# EasyEDA Pro project Loongson_Continuation.epro, schematic Schematic1

## Sheets
1 P1: Board Name: Board1; Create Date: 2025-04-16; Page Name: P1; Project Name: 龙芯拓展板第三版; Schematic Name: Schematic1; Update Date: 2025-06-16; Company: 嘉立创EDA; Page Size: A4; Version: V1.0
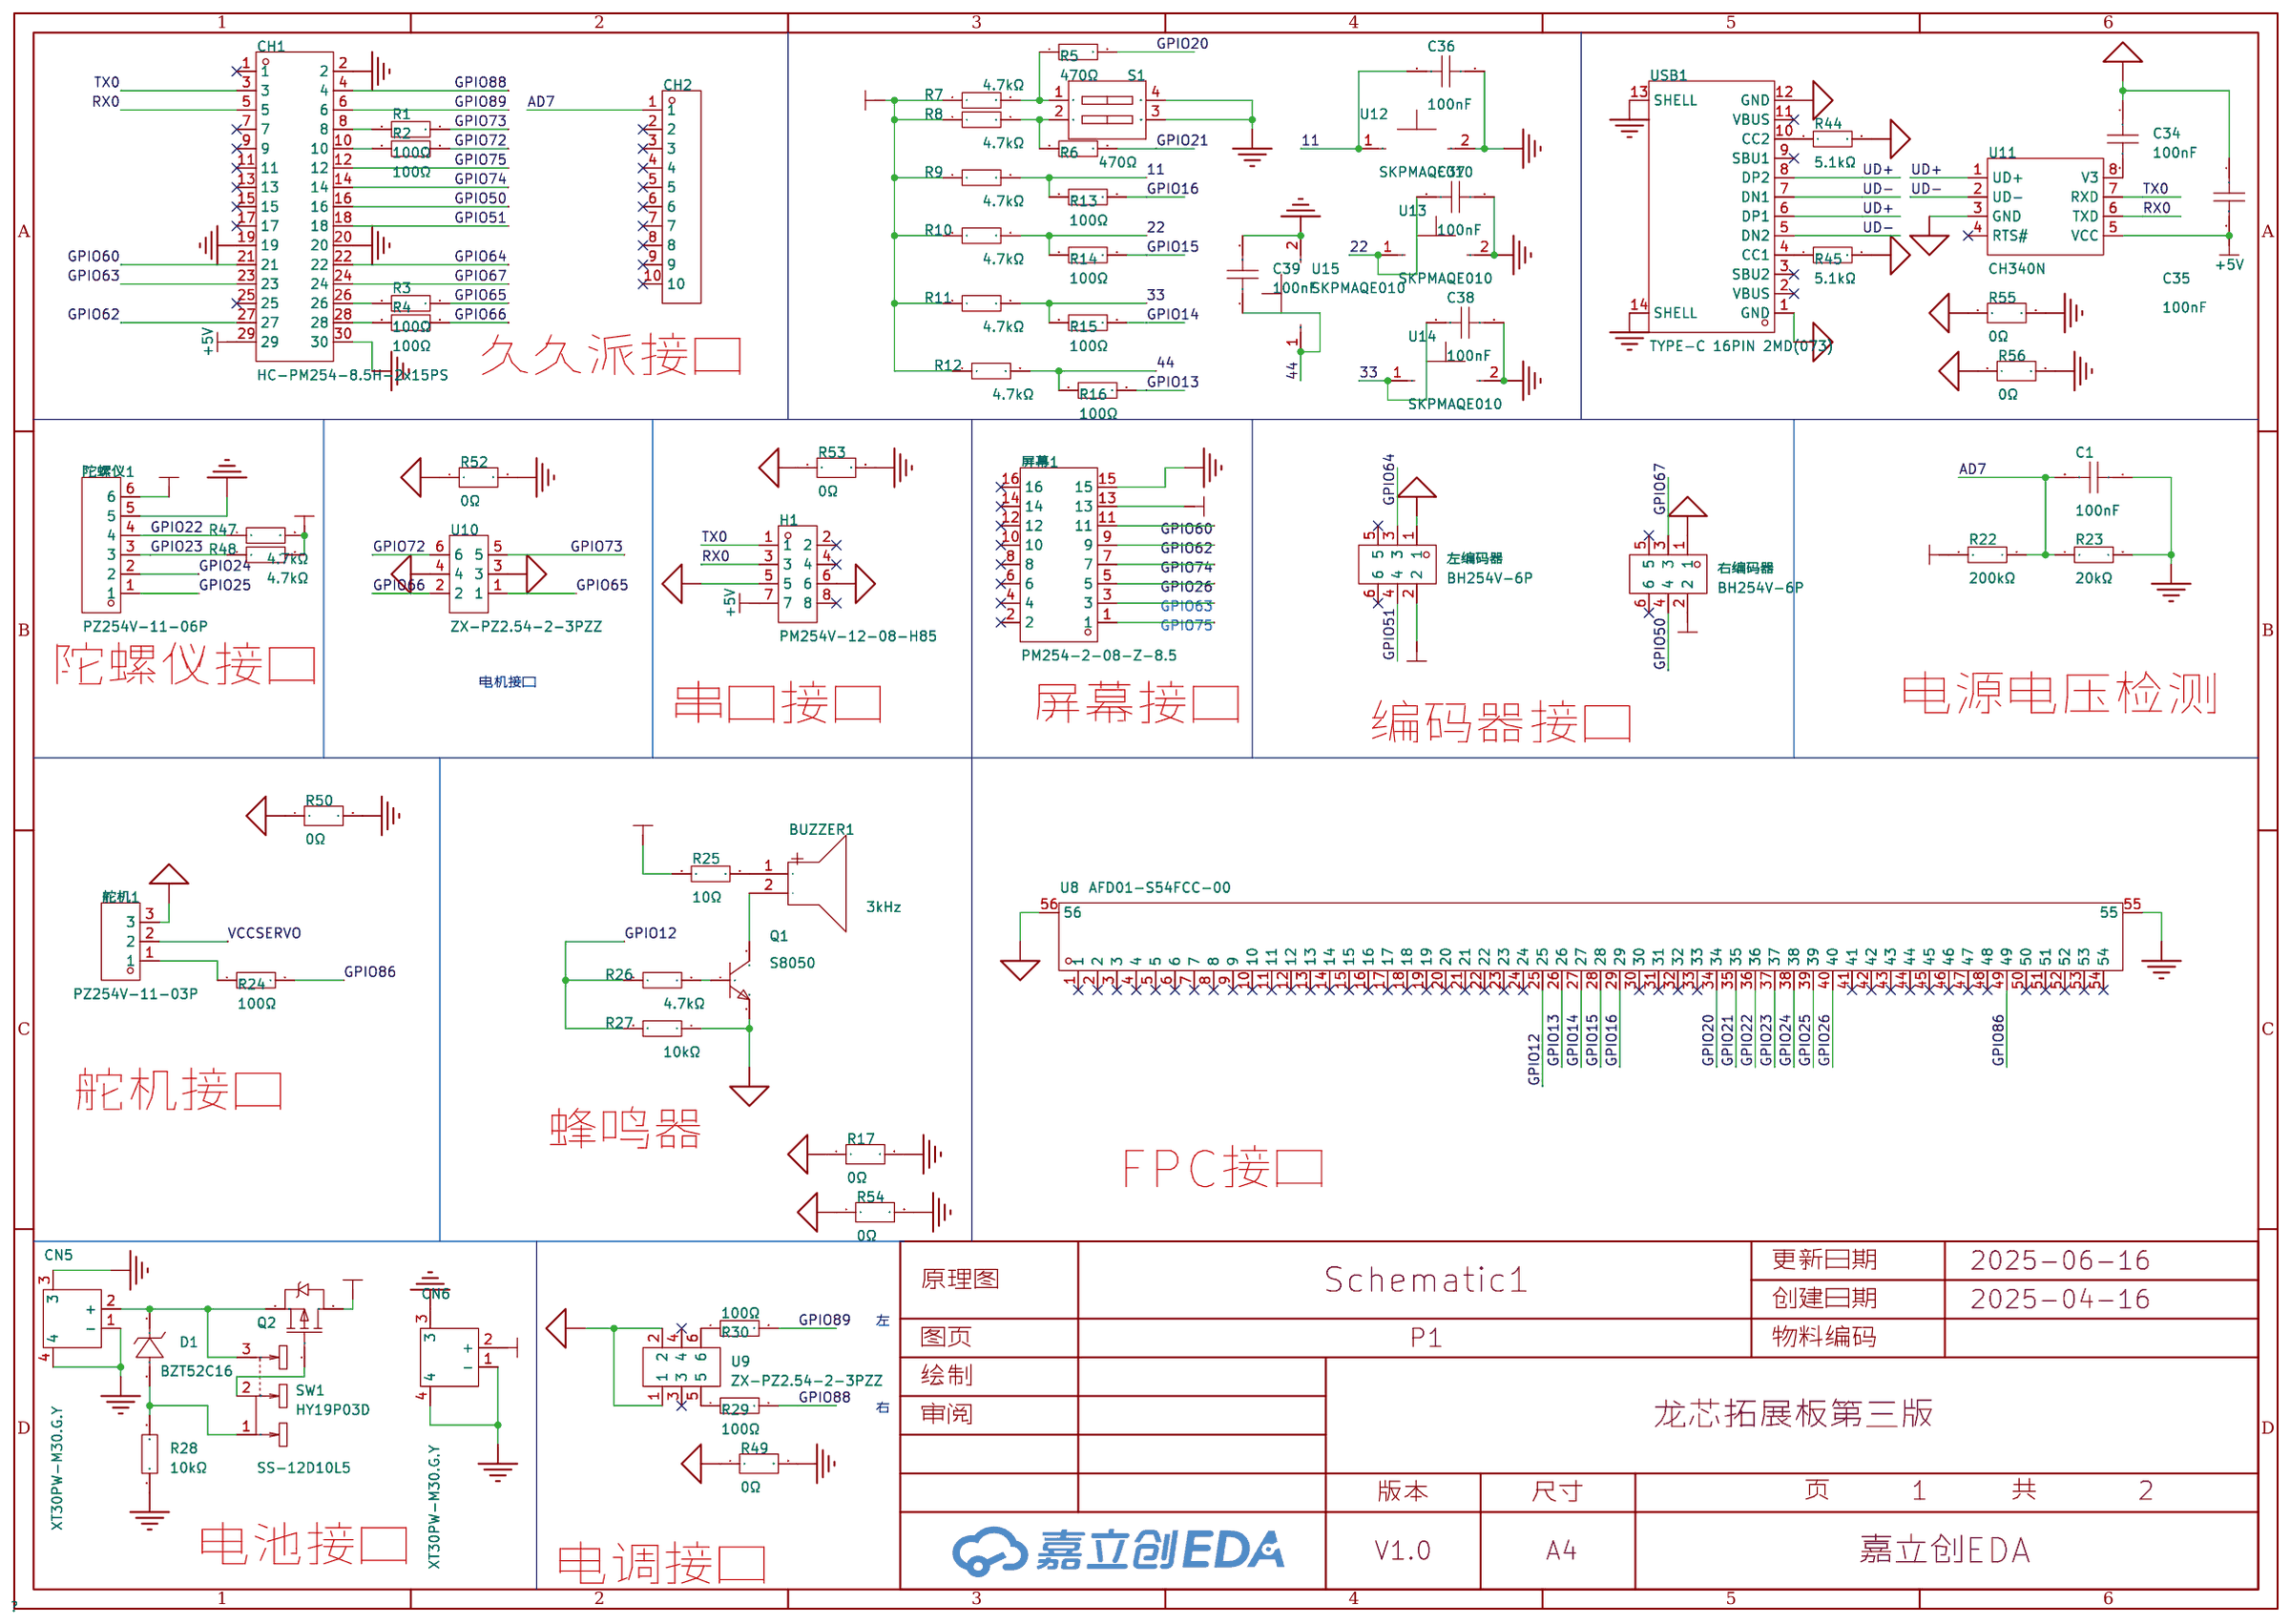
[diagram p0: P1]
2 P2: Page Name: P2; Update Date: 2025-04-16
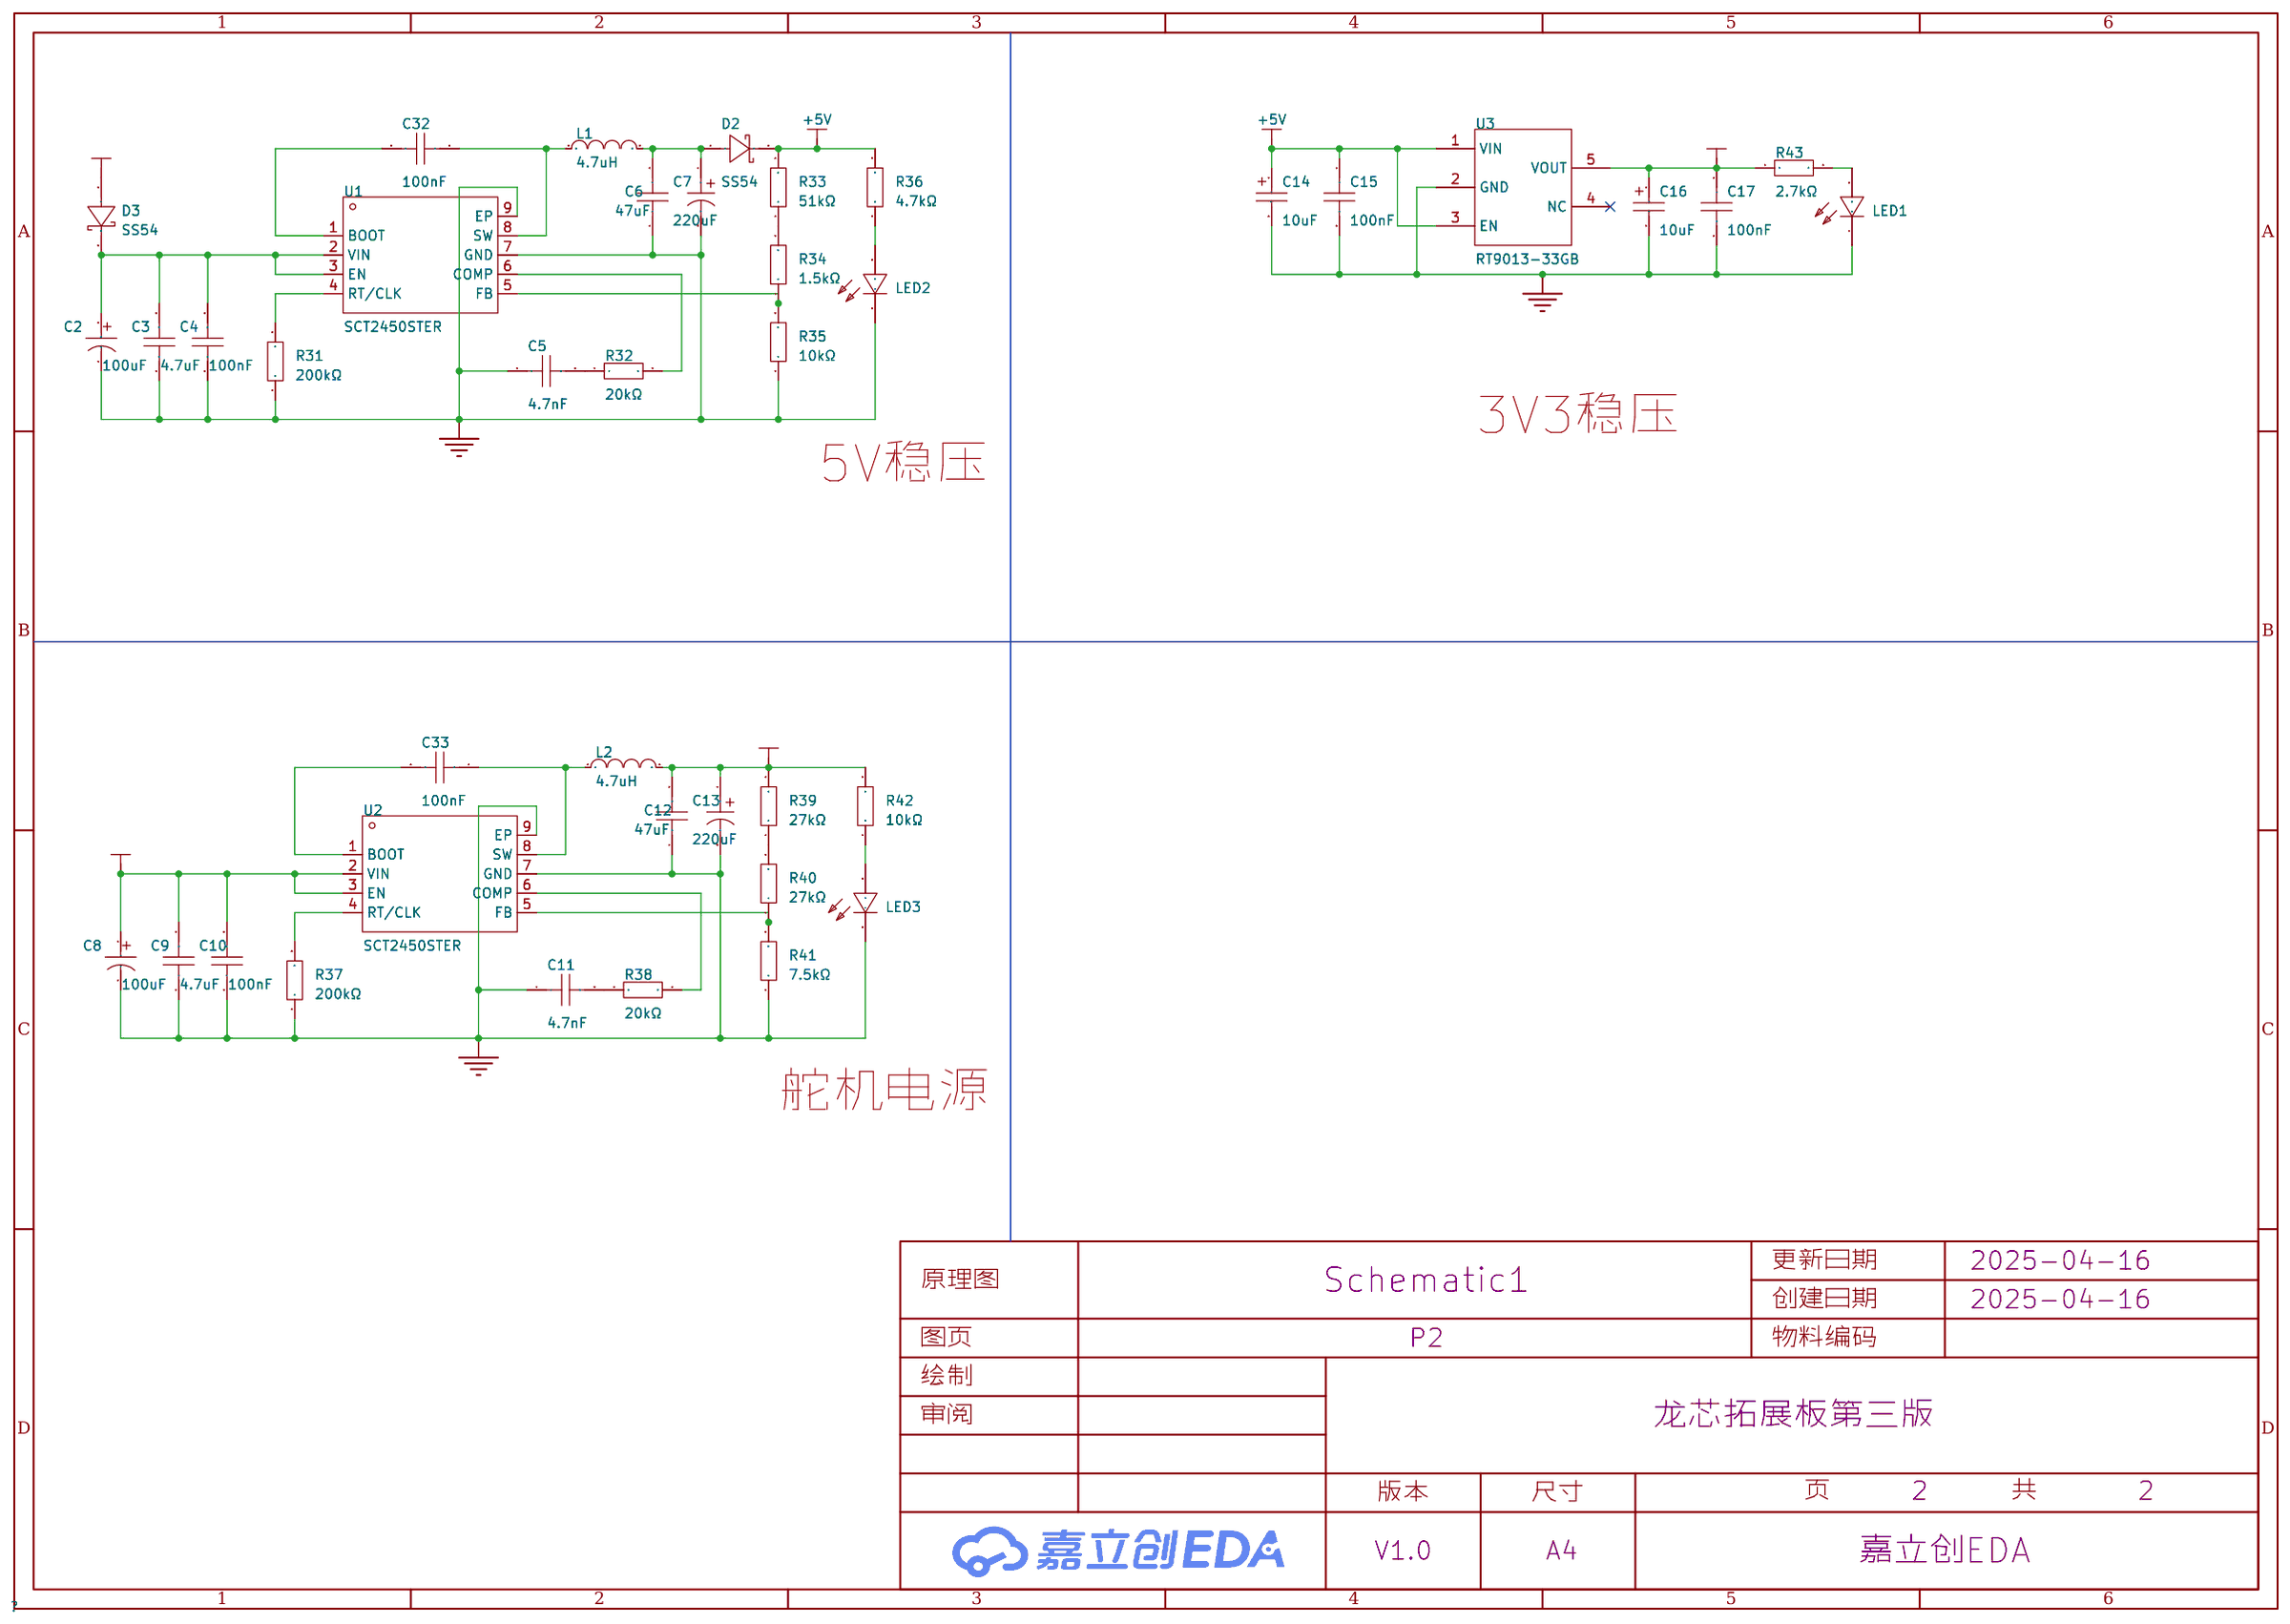
[diagram p1: P2]

## Parts
sheet P1
BUZZER1  3kHz  [BUZ-TH_BD9.0-P5.00-D0.6-FD]
C1  100nF  [C0603]
C34  100nF  [C0603]
C35  100nF  [C0603]
C36  100nF  [C0603]
C37  100nF  [C0603]
C38  100nF  [C0603]
C39  100nF  [C0603]
CH1  HC-PM254-8.5H-2x15PS  [HDR-SMD_30P-P2.54-V-F-R2-C15-LS7.1-1]
CH2  HX PM2.54-1x10P TP-YQ  [HDR-SMD_10P-P2.54-V-F-LS4.7_R2]
CN5  XT30PW-M30.G.Y  [CONN-TH_XT30PW-M]
CN6  XT30PW-M30.G.Y  [CONN-TH_XT30PW-M]
D1  BZT52C16  [SOD-123_L2.7-W1.6-LS3.7-RD]
H1  PM254V-12-08-H85  [HDR-TH_8P-P2.54-V-F-R2-C4-S2.54]
Q1  S8050  [SOT-23-3_L2.9-W1.6-P1.90-LS2.8-BR]
Q2  HY19P03D  [TO-252-2_L6.6-W6.1-P4.57-LS9.9-TL-CW]
R1  100Ω  [R0603]
R2  100Ω  [R0603]
R3  100Ω  [R0603]
R4  100Ω  [R0603]
R5  470Ω  [R0603]
R6  470Ω  [R0603]
R7  4.7kΩ  [R0603]
R8  4.7kΩ  [R0603]
R9  4.7kΩ  [R0603]
R10  4.7kΩ  [R0603]
R11  4.7kΩ  [R0603]
R12  4.7kΩ  [R0603]
R13  100Ω  [R0603]
R14  100Ω  [R0603]
R15  100Ω  [R0603]
R16  100Ω  [R0603]
R17  0Ω  [R1206]
R22  200kΩ  [R0603]
R23  20kΩ  [R0603]
R24  100Ω  [R0603]
R25  10Ω  [R0603]
R26  4.7kΩ  [R0603]
R27  10kΩ  [R0603]
R28  10kΩ  [R0603]
R29  100Ω  [R0603]
R30  100Ω  [R0603]
R44  5.1kΩ  [R0603]
R45  5.1kΩ  [R0603]
R47  4.7kΩ  [R0603]
R48  4.7kΩ  [R0603]
R49  0Ω  [R1206]
R50  0Ω  [R1206]
R52  0Ω  [R1206]
R53  0Ω  [R1206]
R54  0Ω  [R1206]
R55  0Ω  [R1206]
R56  0Ω  [R1206]
S1  DSIC02LS-P  [SW-SMD_4P-L5.1-W6.1-P2.54-LS9.8]
SW1  SS-12D10L5  [SW-TH_SS-12D10L5]
U8  AFD01-S54FCC-00  [FPC-SMD_54P-P0.50_AFD01-S54FCA-00]
U9  ZX-PZ2.54-2-3PZZ  [HDR-TH_6P-P2.54-V-M-R2-C3-S2.54-1]
U10  ZX-PZ2.54-2-3PZZ  [HDR-TH_6P-P2.54-V-M-R2-C3-S2.54-1]
U11  CH340N  [SOP-8_L4.9-W3.9-P1.27-LS6.0-BL]
U12  SKPMAQE010  [KEY-SMD_2P-L6.0-W6.0-P6.00]
U13  SKPMAQE010  [KEY-SMD_2P-L6.0-W6.0-P6.00]
U14  SKPMAQE010  [KEY-SMD_2P-L6.0-W6.0-P6.00]
U15  SKPMAQE010  [KEY-SMD_2P-L6.0-W6.0-P6.00]
USB1  TYPE-C 16PIN 2MD(073)  [USB-C-SMD_TYPE-C-6PIN-2MD-073]
右编码器  BH254V-6P  [IDC-TH_6P-P2.54-V-R2-C3-S2.54]
屏幕1  PM254-2-08-Z-8.5  [HDR-TH_16P-P2.54-V-F-R2-C8-S2.54]
左编码器  BH254V-6P  [IDC-TH_6P-P2.54-V-R2-C3-S2.54]
舵机1  PZ254V-11-03P  [HDR-TH_3P-P2.54-V-M]
陀螺仪1  PZ254V-11-06P  [HDR-TH_6P-P2.54-V-M]
sheet P2
C2  100uF  [CAP-SMD_BD6.3-L6.6-W6.6-LS7.6-FD]
C3  4.7uF  [C1206]
C4  100nF  [C0603]
C5  4.7nF  [C0603]
C6  47uF  [C1206]
C7  220uF  [CAP-SMD_BD6.3-L6.6-W6.6-LS7.4-FD]
C8  100uF  [CAP-SMD_BD6.3-L6.6-W6.6-LS7.6-FD]
C9  4.7uF  [C1206]
C10  100nF  [C0603]
C11  4.7nF  [C0603]
C12  47uF  [C1206]
C13  220uF  [CAP-SMD_BD6.3-L6.6-W6.6-LS7.4-FD]
C14  10uF  [CAP-SMD_L3.2-W1.6-RD-C7171]
C15  100nF  [C0603]
C16  10uF  [CAP-SMD_L3.2-W1.6-RD-C7171]
C17  100nF  [C0603]
C32  100nF  [C0603]
C33  100nF  [C0603]
D2  SS54  [SMA_L4.3-W2.6-LS5.0-FD]
D3  SS54  [SMA_L4.3-W2.6-LS5.0-FD]
L1  4.7uH  [IND-SMD_L5.4-W5.2_FXL0530]
L2  4.7uH  [IND-SMD_L5.4-W5.2_FXL0530]
LED1  NCD0603R1  [LED0603-RD_RED]
LED2  NCD0603R1  [LED0603-RD_RED]
LED3  NCD0603B1  [LED0603-RD]
R31  200kΩ  [R0603]
R32  20kΩ  [R0603]
R33  51kΩ  [R0603]
R34  1.5kΩ  [R0603]
R35  10kΩ  [R0603]
R36  4.7kΩ  [R0603]
R37  200kΩ  [R0603]
R38  20kΩ  [R0603]
R39  27kΩ  [R0603]
R40  27kΩ  [R0603]
R41  7.5kΩ  [R0603]
R42  10kΩ  [R0603]
R43  2.7kΩ  [R0603]
U1  SCT2450STER  [ESOP-8_L4.9-W3.9-P1.27-LS6.0-BL-EP]
U2  SCT2450STER  [ESOP-8_L4.9-W3.9-P1.27-LS6.0-BL-EP]
U3  RT9013-33GB  [SOT-23-5_L3.0-W1.7-P0.95-LS2.8-BL]

## Library data of the parts
BUZZER1 = HNB09A03: 驱动方式:有源(内含驱动线路);构造类型:电磁式;频率:3kHz;声压(SPL):85dB;; LCSC Part Name: 电磁式有源一体蜂鸣器HNB09A03; Supplier Part: C96102; Manufacturer: 华能; Supplier Footprint: 插件,D=9mm; JLCPCB Part Class: 扩展库; Datasheet: https://atta.szlcsc.com/upload/public/pdf/source/20241128/61C4C8C3938BB25F7C38FBE94CCE8DCF.pdf; Supplier: LCSC; Driver Circuitry: 有源(内含驱动线路); Technology: 电磁式; Voltage - Supply: 1.5V~4.5V; Current Consumption: 30mA; Sound Pressure Level(SPL): 85dB; Diameter(φD): 9mm; Height: 5.5mm; Operating Temperature: -20℃~+70℃
C1 C4 C10 C15 C17 C32-C39 = CGA0603X7R104K500JT: 容值:100nF;精度:±10%;额定电压:50V;材质(温度系数):X7R;; LCSC Part Name: 100nF ±10% 50V; Supplier Part: C6119867; Manufacturer: HRE(芯声); Supplier Footprint: 0603; JLCPCB Part Class: 扩展库; Supplier: LCSC; Tolerance: ±10%; Voltage Rated: 50V; Temperature Coefficient: X7R
CH1 = HC-PM254-8.5H-2x15PS: 插孔结构:2x15P;间距:2.54mm;行距:2.54mm;圆孔/方孔:方孔;安装方式:立贴;排数:双排;总孔位数:30P;额定电流:3A;额定电压:-;插孔方向:顶部;塑高:8.5mm;触头材质:黄铜;触头镀层:金;工作温度:-40℃~+105℃;; LCSC Part Name: 间距2.54mm 2x15Pin 立贴 PW7.1 H8.5; Supplier Part: C22436162; Manufacturer: HC(虹成电子); Supplier Footprint: SMD,P=2.54mm; JLCPCB Part Class: 扩展库; Datasheet: https://atta.szlcsc.com/upload/public/pdf/source/20250106/3F7BD0B657317383F8764DF35D106174.pdf; Supplier: LCSC; Holes Structure: 2x15P; Pitch: 2.54mm; Row Spacing: 2.54mm; Circular Hole / Square Hole: 方孔; Mounting Type: 立贴; Number of Rows: 双排; Number of Positions: 30P; Current Rating: 3A; Holes Direction: 顶部; Insulation Height: 8.5mm; Contact Material: 黄铜; Contact Plating: 金; Operating Temperature: -40℃~+105℃
CH2 = HX PM2.54-1x10P TP-YQ: 插孔结构:1x10P;间距:2.54mm;行距:-;圆孔/方孔:方孔;安装类型:立贴;排数:单排;总孔位数:10P;额定电流:3A;插孔方向:顶部;塑高:5mm;触头镀层:金;工作温度范围:-40℃~+105℃;; LCSC Part Name: 间距:2.54mm 1x10P 立贴 (交错脚); Supplier Part: C42379201; Manufacturer: hanxia(韩下); Supplier Footprint: SMD,P=2.54mm(交错脚); Datasheet: https://atta.szlcsc.com/upload/public/pdf/source/20241112/1B0821B5F82B034A310C73580E919DF4.pdf; Supplier: LCSC; Holes Structure: 1x10P; Pitch: 2.54mm; Circular Hole / Square Hole: 方孔; Mounting Type: 立贴; Number of Rows: 单排; Number of Holes: 10P; Current Rating (Max): 3A; Holes Direction: 顶部; Insulation Height: 5mm; Contact Plating: 金; Operating Temperature Range: -40℃~+105℃
CN5 CN6 = XT30PW-M30.G.Y: 类别:-;类型1:-;; LCSC Part Name: AMASS(艾迈斯)航模插头 卧式弯脚 XT30PW-M公头; Supplier Part: C431092; Manufacturer: AMASS(艾迈斯); JLCPCB Part Class: 扩展库; Datasheet: https://atta.szlcsc.com/upload/public/pdf/source/20220222/6A9F22F7850E25B33E1BE430ADF8560B.pdf; Supplier: LCSC; Type: 航模插头; RatedVoltage: DC 500V; InterfaceType: 公头; RatedCurrent: 15A; RecommendedWireGauge: 16/18/20AWG; contact resistance: 1.2mΩ; specifications: 2pin
D1 = BZT52C16_C19077413: 二极管配置:独立式;稳压值(标称值):16V;稳压值(范围):15.2V~16.8V;耗散功率(Pd):500mW;; Supplier Part: C19077413; Manufacturer: 宏嘉诚; Supplier Footprint: SOD-123; JLCPCB Part Class: 扩展库; Datasheet: https://atta.szlcsc.com/upload/public/pdf/source/20250106/E12AA82D484C9C66E469D005F460C1F7.pdf; Supplier: LCSC; Diode Configuration: 独立式; Zener Voltage(Nom): 16V; Reverse Leakage Current (Ir): 100nA@11.2V; Zener Voltage(Range): 15.2V~16.8V; Pd - Power Dissipation(Pd): 500mW; Impedance(Zzt): 45Ω
H1 = PM254V-12-08-H85: 插孔结构:2x4P;间距:2.54mm;行距:2.54mm;圆孔/方孔:方孔;安装类型:直插;排数:双排;总孔位数:8P;额定电流:3A;额定电压:250V;插孔方向:顶部;塑高:8.5mm;工作温度范围:-40℃~+105℃;; LCSC Part Name: 间距:2.54mm 2x4P 直插; Supplier Part: C2834799; Manufacturer: XFCN(兴飞); Supplier Footprint: 插件,P=2.54mm; JLCPCB Part Class: Extended Part; Datasheet: https://atta.szlcsc.com/upload/public/pdf/source/20200309/C492399_8C441E2934FBB604A89B37A68AA45ECF.pdf; Supplier: LCSC; Holes Structure: 2x4P; Pitch: 2.54mm; Row Spacing: 2.54mm; Circular Hole / Square Hole: 方孔; Mounting Type: 直插; Number of Rows: 双排; Number of Holes: 8P; Current Rating (Max): 3A; Voltage Rating (Max): 250V; Holes Direction: 顶部; Insulation Height: 8.5mm; Operating Temperature Range: -40℃~+105℃
Q1 = S8050_C181158: 晶体管类型:NPN;集电极电流(Ic):500mA;集射极击穿电压(Vceo):25V;功率(Pd):300mW;; LCSC Part Name: NPN 电流:500mA 耐压:25V H档; Supplier Part: C181158; Manufacturer: Hottech(合科泰); Supplier Footprint: SOT-23; JLCPCB Part Class: 扩展库; Datasheet: https://atta.szlcsc.com/upload/public/pdf/source/20220506/D987F39D56F2975D34EC7947E75C4ABC.pdf; Supplier: LCSC; Transistor Type: NPN; Collector Current (Ic): 500mA; Collector-Emitter Breakdown Voltage (Vceo): 25V; Power Dissipation (Pd): 300mW; Transition Frequency (fT): 150MHz; Collector Cut-Off Current (Icbo): 100nA; Collector-Emitter Saturation Voltage (VCE(sat)@Ic,Ib): 600mV@500mA,50mA
Q2 = HY19P03D: 类型:P沟道;漏源电压(Vdss):30V;连续漏极电流(Id):90A;功率(Pd):50W;导通电阻(RDS(on)@Vgs,Id):6mΩ@10V,45A;阈值电压(Vgs(th)@Id):3V@250uA;; LCSC Part Name: P沟道 耐压:30V 电流:90A; Supplier Part: C122492; Manufacturer: HUAYI(华羿微); Supplier Footprint: TO-252-2; JLCPCB Part Class: 扩展库; Datasheet: https://atta.szlcsc.com/upload/public/pdf/source/20170728/C122492_1501225751911848809.pdf; Supplier: LCSC; Type: P沟道; Drain Source Voltage (Vdss): 30V; Continuous Drain Current (Id): 90A; Power Dissipation (Pd): 50W; Drain Source On Resistance (RDS(on)@Vgs,Id): 6mΩ@10V,45A; Gate Threshold Voltage (Vgs(th)@Id): 3V@250uA
R1-R4 R13-R16 R24 R29 R30 = 0603WAF1000T5E: 电阻类型:厚膜电阻;阻值:100Ω;精度:±1%;功率:100mW;最大工作电压:75V;温度系数:±200ppm/℃;; LCSC Part Name: 100Ω ±1% 100mW 厚膜电阻; Supplier Part: C22775; Manufacturer: UNI-ROYAL(厚声); Supplier Footprint: 0603; JLCPCB Part Class: 基础库; Datasheet: https://atta.szlcsc.com/upload/public/pdf/source/20200306/C422600_1E6D84923E4A46A82E41ADD87F860B5C.pdf; Supplier: LCSC; Type: 厚膜电阻; Tolerance: ±1%; Power(Watts): 100mW; Overload Voltage (Max): 75V; Temperature Coefficient: ±200ppm/℃; Operating Temperature Range: -55℃~+155℃
R5 R6 = 0603WAF4700T5E: 电阻类型:厚膜电阻;阻值:470Ω;精度:±1%;功率:100mW;最大工作电压:75V;温度系数:±100ppm/℃;; LCSC Part Name: 470Ω ±1% 100mW 厚膜电阻; Supplier Part: C23179; Manufacturer: UNI-ROYAL(厚声); Supplier Footprint: 0603; JLCPCB Part Class: 基础库; Datasheet: https://atta.szlcsc.com/upload/public/pdf/source/20200306/C422600_1E6D84923E4A46A82E41ADD87F860B5C.pdf; Supplier: LCSC; Type: 厚膜电阻; Tolerance: ±1%; Power(Watts): 100mW; Overload Voltage (Max): 75V; Temperature Coefficient: ±100ppm/℃; Operating Temperature Range: -55℃~+155℃
R7-R12 R26 R36 R47 R48 = 0603WAF4701T5E: 电阻类型:厚膜电阻;阻值:4.7kΩ;精度:±1%;功率:100mW;最大工作电压:75V;温度系数:±100ppm/℃;; LCSC Part Name: 4.7kΩ ±1% 100mW 厚膜电阻; Supplier Part: C23162; Manufacturer: UNI-ROYAL(厚声); Supplier Footprint: 0603; JLCPCB Part Class: 基础库; Datasheet: https://atta.szlcsc.com/upload/public/pdf/source/20200306/C422600_1E6D84923E4A46A82E41ADD87F860B5C.pdf; Supplier: LCSC; Type: 厚膜电阻; Tolerance: ±1%; Power(Watts): 100mW; Overload Voltage (Max): 75V; Temperature Coefficient: ±100ppm/℃; Operating Temperature Range: -55℃~+155℃
R17 R49 R50 R52-R56 = FRC1206P000 TS: 电阻类型:厚膜电阻;阻值:0Ω;精度:±5%;功率:250mW;最大工作电压:200V;; LCSC Part Name: 0Ω ±5% 250mW 厚膜电阻; Supplier Part: C2907406; Manufacturer: FOJAN(富捷); Supplier Footprint: 1206; JLCPCB Part Class: 扩展库; Datasheet: https://atta.szlcsc.com/upload/public/pdf/source/20211221/925EC7D7225764EE0046F22065062C87.pdf; Supplier: LCSC; Type: 厚膜电阻; Tolerance: ±5%; Power(Watts): 250mW; Overload Voltage (Max): 200V; Operating Temperature Range: -55℃~+155℃
R22 R31 R37 = 0603WAF2003T5E: 电阻类型:厚膜电阻;阻值:200kΩ;精度:±1%;功率:100mW;最大工作电压:75V;温度系数:±100ppm/℃;; LCSC Part Name: 200kΩ ±1% 100mW 厚膜电阻; Supplier Part: C25811; Manufacturer: UNI-ROYAL(厚声); Supplier Footprint: 0603; JLCPCB Part Class: 基础库; Datasheet: https://atta.szlcsc.com/upload/public/pdf/source/20200306/C422600_1E6D84923E4A46A82E41ADD87F860B5C.pdf; Supplier: LCSC; Type: 厚膜电阻; Tolerance: ±1%; Power(Watts): 100mW; Overload Voltage (Max): 75V; Temperature Coefficient: ±100ppm/℃; Operating Temperature Range: -55℃~+155℃
R23 R32 R38 = 0603WAF2002T5E: 电阻类型:厚膜电阻;阻值:20kΩ;精度:±1%;功率:100mW;最大工作电压:75V;温度系数:±100ppm/℃;; LCSC Part Name: 20kΩ ±1% 100mW 厚膜电阻; Supplier Part: C4184; Manufacturer: UNI-ROYAL(厚声); Supplier Footprint: 0603; JLCPCB Part Class: 基础库; Datasheet: https://atta.szlcsc.com/upload/public/pdf/source/20200306/C422600_1E6D84923E4A46A82E41ADD87F860B5C.pdf; Supplier: LCSC; Type: 厚膜电阻; Tolerance: ±1%; Power(Watts): 100mW; Overload Voltage (Max): 75V; Temperature Coefficient: ±100ppm/℃; Operating Temperature Range: -55℃~+155℃
R25 = 0603WAF100JT5E: 电阻类型:厚膜电阻;阻值:10Ω;精度:±1%;功率:100mW;最大工作电压:75V;温度系数:±400ppm/℃;; LCSC Part Name: 10Ω ±1% 100mW 厚膜电阻; Supplier Part: C22859; Manufacturer: UNI-ROYAL(厚声); Supplier Footprint: 0603; JLCPCB Part Class: 基础库; Datasheet: https://atta.szlcsc.com/upload/public/pdf/source/20200306/C422600_1E6D84923E4A46A82E41ADD87F860B5C.pdf; Supplier: LCSC; Type: 厚膜电阻; Tolerance: ±1%; Power(Watts): 100mW; Overload Voltage (Max): 75V; Temperature Coefficient: ±400ppm/℃; Operating Temperature Range: -55℃~+155℃
R27 R28 R35 R42 = 0603WAF1002T5E: 电阻类型:厚膜电阻;阻值:10kΩ;精度:±1%;功率:100mW;最大工作电压:75V;温度系数:±100ppm/℃;; LCSC Part Name: 厚膜电阻 10kΩ ±1% 100mW; Supplier Part: C25804; Manufacturer: UNI-ROYAL(厚声); Supplier Footprint: 0603; JLCPCB Part Class: 基础库; Datasheet: https://atta.szlcsc.com/upload/public/pdf/source/20200306/C422600_1E6D84923E4A46A82E41ADD87F860B5C.pdf; Supplier: LCSC; Type: 厚膜电阻; Tolerance: ±1%; Power(Watts): 100mW; Overload Voltage (Max): 75V; Temperature Coefficient: ±100ppm/℃; Operating Temperature Range: -55℃~+155℃
R44 R45 = 0603WAF5101T5E: 电阻类型:厚膜电阻;阻值:5.1kΩ;精度:±1%;功率:100mW;最大工作电压:75V;温度系数:±100ppm/℃;; LCSC Part Name: 5.1kΩ ±1% 100mW 厚膜电阻; Supplier Part: C23186; Manufacturer: UNI-ROYAL(厚声); Supplier Footprint: 0603; JLCPCB Part Class: 基础库; Datasheet: https://atta.szlcsc.com/upload/public/pdf/source/20200306/C422600_1E6D84923E4A46A82E41ADD87F860B5C.pdf; Supplier: LCSC; Type: 厚膜电阻; Tolerance: ±1%; Power(Watts): 100mW; Overload Voltage (Max): 75V; Temperature Coefficient: ±100ppm/℃; Operating Temperature Range: -55℃~+155℃
S1 = DSIC02LS-P_C489174: 类型:平拨,凸起式;电路结构:单刀单掷;开关位数:2位;额定电流:25mA;额定电压:24V;使用寿命:3千次;颜色:黑色;; LCSC Part Name: 间距2.54mm 平拨,凸起式 2位拨码开关; Supplier Part: C489174; Manufacturer: XKB Connectivity(中国星坤); Supplier Footprint: SMD-4P,5.1x6.1mm; JLCPCB Part Class: 扩展库; Datasheet: https://atta.szlcsc.com/upload/public/pdf/source/20200227/C424380_7B5FE7C891E0521A8B96890FFC9096F0.pdf; Supplier: LCSC; Type: 平拨,凸起式; Circuit: 单刀单掷; Number of Positions: 2位; Pin Style: 鸥翼型; Lead Pitch: 2.54mm; Current Rating: 25mA; Voltage Rating: 24V; Operating Temperature: -20℃~+70℃; Operating Life: 3千次; Color: 黑色
SW1 = SS-12D10L5: 电路结构:单刀双掷;安装方式:直插;开关颜色:黑色;额定电流(DC):3A;额定电压(DC):125V;额定电流(AC):3A;额定电压(AC):125V;机械寿命:1万次;; LCSC Part Name: 柄长5mm 直插双档 滑动开关; Supplier Part: C319012; Manufacturer: XKB Connectivity(中国星坤); Supplier Footprint: 插件; JLCPCB Part Class: 扩展库; Datasheet: https://atta.szlcsc.com/upload/public/pdf/source/20211009/D6412F37AABE6F9459A6EE7FA4DAEADB.pdf; Supplier: LCSC; Circuit: 单刀双掷; Actuator Style: 矩形柱状; Pin Style: PC引脚; Switch Length: 13mm; Switch Width: 6.8mm; Switch Height: 6.4mm; Mounting Style: 直插; Actuator Color: 黑色; Current Rating (DC): 3A; Voltage Rating (DC): 125V; Current Rating (AC): 3A; Voltage Rating (AC): 125V; Mechanical Life: 1万次; Operating Temperature: -40℃~+85℃
U8 = AFD01-S54FCC-00: 锁定特性:翻盖式;触点类型:下接;触点数量:54P;间距:0.5mm;安装类型:卧贴;; LCSC Part Name: 间距:0.5mm P数:54P 翻盖式 下接; Supplier Part: C18198568; Manufacturer: JS(钜硕电子); Supplier Footprint: SMD,P=0.5mm,卧贴; JLCPCB Part Class: 扩展库; Datasheet: https://atta.szlcsc.com/upload/public/pdf/source/20230921/C984413AEFF3A883511B509B58F9A1F7.pdf; Supplier: LCSC; Locking Feature: 翻盖式; Contact Type: 下接; Number of Contacts: 54P; Pitch: 0.5mm; Mounting Type: 卧贴; Height Above Board: 2mm
U9 U10 = ZX-PZ2.54-2-3PZZ: 插针结构:2x3P;间距:2.54mm;行距:2.54mm;圆针/方针:方针;安装方式:直插;排数:双排;总PIN位数:6P;额定电流:3A;额定电压:1kV;配合针长度:6mm;塑高:2.5mm;端接针长度:3mm;触头材质:黄铜;触头镀层:金;工作温度:-40℃~+105℃;颜色:黑色;; LCSC Part Name: 2x3P 间距:2.54mm 方针 直插; Supplier Part: C7501274; Manufacturer: Megastar(兆星); Supplier Footprint: 插件,P=2.54mm; JLCPCB Part Class: 扩展库; Datasheet: https://atta.szlcsc.com/upload/public/pdf/source/20231122/E8390501A702A71E626C593F036B3607.pdf; Supplier: LCSC; Pin Structure: 2x3P; Pitch: 2.54mm; Row Spacing: 2.54mm; Circluar Pins/Square Pins: 方针; Mounting Type: 直插; Number of Rows: 双排; Number of Pins: 6P; Current Rating: 3A; Voltage Rating (Max): 1kV; Length of Mating Pin: 6mm; Insulation Height: 2.5mm; Length of End Connection Pin: 3mm; Contact Material: 黄铜; Contact Plating: 金; Operating Temperature: -40℃~+105℃; Color: 黑色
U11 = CH340N: 应用功能:USB转串口;接口协议:USB 2.0;通道数:1;数据速率:2Mbps;; LCSC Part Name: USB2.0芯片CH340; Supplier Part: C2977777; Manufacturer: WCH(南京沁恒); Supplier Footprint: SOP-8; JLCPCB Part Class: 扩展库; Datasheet: https://atta.szlcsc.com/upload/public/pdf/source/20240313/115CDE92081B1D6CB446704AD5D0F5F2.pdf; Supplier: LCSC; Applications Function: USB转串口; Protocol: USB 2.0; Number of Channels: 1; Voltage - Supply: 3.3V；5V; Data Rate: 2Mbps; Operating Temperature: -20℃~+70℃
U12-U15 = SKPMAQE010: 6*6*5mm 立贴 硅胶软开关 无声静音开关 电路结构:单刀单掷 触点电流:50mA 额定电压(DC):16V 安装方式:立贴 动作力:3.5N 操作寿命:5万次 行程:1.3mm 用途:汽车音响,汽车导航,音响设备,手持设备,通讯设备,测量仪器等各种操作; Supplier Part: C19274389; Manufacturer: ALPSALPINE(阿尔卑斯阿尔派); Supplier Footprint: SMD,6.6x6mm; JLCPCB Part Class: 扩展库; Datasheet: https://atta.szlcsc.com/upload/public/pdf/source/20231201/D724ADF6978EA66A095344C51B88B412.pdf; Supplier: LCSC
USB1 = TYPE-C 16PIN 2MD(073): 连接器类型:Type-C;标准:USB 3.1;公母:母;安装方式:卧贴;触点数量:16P;端口数量:1;额定电流 - 电源:5A;工作温度范围:-25℃~+85℃;; LCSC Part Name: Type-C 母 卧贴; Supplier Part: C2765186; Manufacturer: SHOU HAN(首韩); Supplier Footprint: SMD; JLCPCB Part Class: 扩展库; Datasheet: https://atta.szlcsc.com/upload/public/pdf/source/20211123/39B17C16241EAC15C5E277BDA434118E.pdf; Supplier: LCSC; Connector Type: Type-C; Standard: USB 3.1; Gender: 母; Mounting Style: 卧贴; Number of Contacts: 16P; Number of Ports: 1; Current Rating - Power (Max): 5A; Operating Temperature Range: -25℃~+85℃; Rated Voltage (Max): 5V; Connect-Disconnect Life: 5千次; Core Colour: 黑色
右编码器 左编码器 = BH254V-6P: 连接器类型:简牛座;间距:2.54mm;结构:2x3P;额定电流:3A;额定电压:250V;封装形式:直插;行距:2.54mm;排数:2;每排PIN数:3;工作温度范围:-40℃~+105℃;; LCSC Part Name: 2.54mm 2x3P 排数:2 每排P数:3; Supplier Part: C492441; Manufacturer: XFCN(兴飞); Supplier Footprint: 插件,P=2.54mm; JLCPCB Part Class: 扩展库; Datasheet: https://atta.szlcsc.com/upload/public/pdf/source/20200312/C492444_4AABE2FC4F6BE8226B85135616AF0092.pdf; Supplier: LCSC; Connector Type: 简牛座; Pitch: 2.54mm; Structure: 2x3P; Current Rating (Max): 3A; Voltage Rating (Max): 250V; Holder Type: 直插; Row Spacing: 2.54mm; Number of Rows: 2; Pin Number in each Row: 3; Operating Temperature Range: -40℃~+105℃
屏幕1 = PM254-2-08-Z-8.5: 插孔结构:2x8P;间距:2.54mm;行距:2.54mm;圆孔/方孔:方孔;安装类型:直插;排数:双排;总孔位数:16P;额定电流:3A;额定电压:-;插孔方向:顶部;塑高:8.5mm;触头材质:铜合金;工作温度范围:-40℃~+105℃;焊接温度(最大值):260℃@5S;; LCSC Part Name: 2x8P 间距:2.54mm 直插; Supplier Part: C2897409; Manufacturer: HCTL(华灿天禄); Supplier Footprint: 插件,P=2.54mm; JLCPCB Part Class: 扩展库; Datasheet: https://atta.szlcsc.com/upload/public/pdf/source/20230609/3D36CA2C1BFC9FD1C3F709AD9DFEB9C2.pdf; Supplier: LCSC; Holes Structure: 2x8P; Pitch: 2.54mm; Row Spacing: 2.54mm; Circular Hole / Square Hole: 方孔; Mounting Type: 直插; Number of Rows: 双排; Number of Holes: 16P; Current Rating (Max): 3A; Holes Direction: 顶部; Insulation Height: 8.5mm; Contact Material: 铜合金; Operating Temperature Range: -40℃~+105℃; Soldering Temperature(Max): 260℃@5S
舵机1 = PZ254V-11-03P: 插针结构:1x3P;间距:2.54mm;行距:-;圆针/方针:方针;安装类型:直插;排数:单排;总PIN位数:3P;额定电流:3A;额定电压:250V;配合针长度:6mm;塑高:2.5mm;端接针长度:3mm;工作温度范围:-40℃~+105℃;颜色:黑色;; LCSC Part Name: 间距:2.54mm 1x3P 直插 方针; Supplier Part: C2937625; Manufacturer: XFCN(兴飞); Supplier Footprint: 插件,P=2.54mm; JLCPCB Part Class: 扩展库; Datasheet: https://atta.szlcsc.com/upload/public/pdf/source/20200309/C492402_8335C3D49C4E4C618838D59BB1D024C1.pdf; Supplier: LCSC; Pin Structure: 1x3P; Pitch: 2.54mm; Circluar Pins/Square Pins: 方针; Mounting Type: 直插; Number of Rows: 单排; Number of Pins: 3P; Current Rating (Max): 3A; Voltage Rating (Max): 250V; Length of Mating Pin: 6mm; Insulation Height: 2.5mm; Length of End Connection Pin: 3mm; Operating Temperature Range: -40℃~+105℃; Color: 黑色
陀螺仪1 = PZ254V-11-06P: 插针结构:1x6P;间距:2.54mm;行距:-;圆针/方针:方针;安装类型:直插;排数:单排;总PIN位数:6P;额定电流:-;额定电压:-;配合针长度:6mm;塑高:2.5mm;端接针长度:3mm;触头材质:黄铜;触头镀层:-;工作温度范围:-40℃~+105℃;颜色:黑色;; LCSC Part Name: 间距:2.54mm 1x6P 直插 方针; Supplier Part: C492405; Manufacturer: XFCN(兴飞); Supplier Footprint: 插件,P=2.54mm; JLCPCB Part Class: 扩展库; Datasheet: https://atta.szlcsc.com/upload/public/pdf/source/20200309/C492405_597F1930F5B55CC3C7FD95458F1C3977.pdf; Supplier: LCSC; Pin Structure: 1x6P; Pitch: 2.54mm; Circluar Pins/Square Pins: 方针; Mounting Type: 直插; Number of Rows: 单排; Number of Pins: 6P; Length of Mating Pin: 6mm; Insulation Height: 2.5mm; Length of End Connection Pin: 3mm; Contact Material: 黄铜; Operating Temperature Range: -40℃~+105℃; Color: 黑色
C2 C8 = RVT1V101M0607: 容值:100uF;精度:±20%;额定电压:35V;纹波电流:69mA@120Hz;等效串联电阻(ESR):-;; LCSC Part Name: 100uF ±20% 35V; Supplier Part: C72478; Manufacturer: ROQANG(容强); Supplier Footprint: SMD,D6.3xL7.7mm; JLCPCB Part Class: 扩展库; Datasheet: https://atta.szlcsc.com/upload/public/pdf/source/20170325/1490427950282.pdf; Supplier: LCSC; Tolerance: ±20%; Voltage Rating: 35V; Ripple Current: 69mA@120Hz; Diameter: 6.3mm; Height - Seated (Max): 7.7mm; Lifetime: 2000hrs@105℃; Operating Temperature: -40℃~+105℃
C3 C9 = CGA1206X5R475K350NT: 容值:4.7uF;精度:±10%;额定电压:35V;材质(温度系数):X5R;; LCSC Part Name: 4.7uF ±10% 35V; Supplier Part: C22399656; Manufacturer: HRE(芯声); Supplier Footprint: 1206; JLCPCB Part Class: 扩展库; Datasheet: https://atta.szlcsc.com/upload/public/pdf/source/20240523/B8FD0004515F911A9E977ED73F0FE1A1.pdf; Supplier: LCSC; Tolerance: ±10%; Voltage Rating: 35V; Temperature Coefficient: X5R
C5 C11 = CGA0603X7R472K500JT: 容值:4.7nF;精度:±10%;额定电压:50V;材质(温度系数):X7R;; LCSC Part Name: 4.7nF ±10% 50V; Supplier Part: C7503499; Manufacturer: HRE(芯声); Supplier Footprint: 0603; JLCPCB Part Class: 扩展库; Supplier: LCSC; Tolerance: ±10%; Voltage Rated: 50V; Temperature Coefficient: X7R
C6 C12 = CGA1206X5R476M250NT: 容值:47uF;精度:±20%;额定电压:25V;材质(温度系数):X5R;; LCSC Part Name: 47uF ±20% 25V; Supplier Part: C6119973; Manufacturer: HRE(芯声); Supplier Footprint: 1206; JLCPCB Part Class: 扩展库; Datasheet: https://atta.szlcsc.com/upload/public/pdf/source/20240229/85D0248657B5565B358B20AFC8F32D04.pdf; Supplier: LCSC; Tolerance: ±20%; Voltage Rated: 25V; Temperature Coefficient: X5R
C7 C13 = RVT1E221M0607: 容值:220uF;精度:±20%;额定电压:25V;纹波电流:150mA@120Hz;等效串联电阻(ESR):-;; LCSC Part Name: 220uF ±20% 25V; Supplier Part: C2918361; Manufacturer: ROQANG(容强); Supplier Footprint: SMD,D6.3xL7.7mm; JLCPCB Part Class: 扩展库; Datasheet: https://atta.szlcsc.com/upload/public/pdf/source/20241024/87413EF5140CF44BEEEC408A2EAB4036.pdf; Supplier: LCSC; Tolerance: ±20%; Voltage Rating: 25V; Ripple Current: 150mA@120Hz; Diameter: 6.3mm; Height - Seated (Max): 7.7mm; Lifetime: 2000hrs@105℃; Operating Temperature: -40℃~+105℃
C14 C16 = TAJA106K016RNJ: 容值:10uF;精度:±10%;额定电压:16V;等效串联电阻:3Ω@100kHz;; LCSC Part Name: 10uF ±10% 16V; Supplier Part: C7171; Manufacturer: Kyocera AVX; Supplier Footprint: CASE-A-3216; JLCPCB Part Class: 基础库; Datasheet: https://atta.szlcsc.com/upload/public/pdf/source/20160107/1457707750344.pdf; Supplier: LCSC; Tolerance: ±10%; Rated Voltage: 16V; Equivalent Series Resistance(ESR): 3Ω@100kHz; Operating Temperature: -55℃~+125℃
D2 D3 = SS54_C7420369: 二极管配置:独立式;正向压降(Vf):550mV@5.0A;直流反向耐压(Vr):40V;整流电流:5A;; LCSC Part Name: 电压:40V 电流:5A; Supplier Part: C7420369; Manufacturer: 宏迦橙; Supplier Footprint: SMA(DO-214AC); JLCPCB Part Class: 扩展库; Datasheet: https://atta.szlcsc.com/upload/public/pdf/source/20230828/254C3882F8647358AD9F60DD73611B5E.pdf; Supplier: LCSC; Diode Configuration: 独立式; Forward Voltage (Vf@If): 550mV@5.0A; Reverse Voltage (Vr): 40V; Rectified Current: 5A; Reverse Leakage Current (Ir): 50uA@40V
L1 L2 = FXL0530-4R7-M: 电感值:4.7uH;精度:±20%;额定电流:4.5A;饱和电流(Isat):5A;类型:一体成型电感;; LCSC Part Name: 4.7uH ±20% 5A; Supplier Part: C177246; Manufacturer: cjiang(长江微电); Supplier Footprint: SMD,5.2x5.4mm; JLCPCB Part Class: 扩展库; Datasheet: https://atta.szlcsc.com/upload/public/pdf/source/20240426/3189EA8206330E2108542F9E34E540E7.pdf; Supplier: LCSC; Tolerance: ±20%; Rated Current: 4.5A; Saturation Current (Isat): 5A; DC Resistance (DCR): 60mΩ; Type: 一体成型电感
LED1 LED2 = NCD0603R1_C84263: 灯头类型:-;发光颜色:红色;正向电压(VF):1.6V~2.6V;功率:65mW;正向电流:20mA;主波长:615nm~630nm;二极管配置:独立二极管;透镜颜色:无色透明透镜;色温:-;发光强度:80mcd~220mcd;发光角度:130°;载带方式:-;工作温度:-30℃~+85℃;; Supplier Part: C84263; Manufacturer: 国星光电; Supplier Footprint: 0603; JLCPCB Part Class: 扩展库; Datasheet: https://atta.szlcsc.com/upload/public/pdf/source/20200820/C84263_DABC6A75E58F576973B407FDBA283D60.pdf; Supplier: LCSC; Emitted Color: 红色; Forward Voltage (VF): 1.6V~2.6V; Power Dissipation: 65mW; Forward Current: 20mA; Dominant Wavelength: 615nm~630nm; Diode Configuration: 独立二极管; Lens Color: 无色透明透镜; Luminous Intensity: 80mcd~220mcd; Viewing Angle: 130°; Operating Temperature: -30℃~+85℃
LED3 = NCD0603B1: 发光颜色:蓝色;正向电压(VF):2.6V~3.6V;功率:72mW;正向电流:10mA;主波长:463nm~475nm;透镜颜色:无色透明透镜;发光强度:80mcd~220mcd;发光角度:130°;工作温度:-30℃~+85℃;; Supplier Part: C84266; Manufacturer: 国星光电; Supplier Footprint: 0603; JLCPCB Part Class: 扩展库; Datasheet: https://atta.szlcsc.com/upload/public/pdf/source/20200820/C84266_6A3CDBEFA72C6CAD68EDA53474ADAE6C.pdf; Supplier: LCSC; Emitted Color: 蓝色; Forward Voltage (VF): 2.6V~3.6V; Power Dissipation: 72mW; Forward Current: 10mA; Dominant Wavelength: 463nm~475nm; Lens Color: 无色透明透镜; Luminous Intensity: 80mcd~220mcd; Viewing Angle: 130°; Operating Temperature: -30℃~+85℃
R33 = 0603WAF5102T5E: 电阻类型:厚膜电阻;阻值:51kΩ;精度:±1%;功率:100mW;最大工作电压:75V;温度系数:±100ppm/℃;; LCSC Part Name: 51kΩ ±1% 100mW 厚膜电阻; Supplier Part: C23196; Manufacturer: UNI-ROYAL(厚声); Supplier Footprint: 0603; JLCPCB Part Class: 基础库; Datasheet: https://atta.szlcsc.com/upload/public/pdf/source/20200306/C422600_1E6D84923E4A46A82E41ADD87F860B5C.pdf; Supplier: LCSC; Type: 厚膜电阻; Tolerance: ±1%; Power(Watts): 100mW; Overload Voltage (Max): 75V; Temperature Coefficient: ±100ppm/℃; Operating Temperature Range: -55℃~+155℃
R34 = 0603WAF1501T5E: 电阻类型:厚膜电阻;阻值:1.5kΩ;精度:±1%;功率:100mW;最大工作电压:75V;温度系数:±100ppm/℃;; LCSC Part Name: 1.5kΩ ±1% 100mW 厚膜电阻; Supplier Part: C22843; Manufacturer: UNI-ROYAL(厚声); Supplier Footprint: 0603; JLCPCB Part Class: 基础库; Datasheet: https://atta.szlcsc.com/upload/public/pdf/source/20200306/C422600_1E6D84923E4A46A82E41ADD87F860B5C.pdf; Supplier: LCSC; Type: 厚膜电阻; Tolerance: ±1%; Power(Watts): 100mW; Overload Voltage (Max): 75V; Temperature Coefficient: ±100ppm/℃; Operating Temperature Range: -55℃~+155℃
R39 R40 = 0603WAF2702T5E: 电阻类型:厚膜电阻;阻值:27kΩ;精度:±1%;功率:100mW;最大工作电压:75V;温度系数:±100ppm/℃;; LCSC Part Name: 27kΩ ±1% 100mW 厚膜电阻; Supplier Part: C22967; Manufacturer: UNI-ROYAL(厚声); Supplier Footprint: 0603; JLCPCB Part Class: 基础库; Datasheet: https://atta.szlcsc.com/upload/public/pdf/source/20200306/C422600_1E6D84923E4A46A82E41ADD87F860B5C.pdf; Supplier: LCSC; Type: 厚膜电阻; Tolerance: ±1%; Power(Watts): 100mW; Overload Voltage (Max): 75V; Temperature Coefficient: ±100ppm/℃; Operating Temperature Range: -55℃~+155℃
R41 = 0603WAF7501T5E: 电阻类型:厚膜电阻;阻值:7.5kΩ;精度:±1%;功率:100mW;最大工作电压:75V;温度系数:±100ppm/℃;; LCSC Part Name: 7.5kΩ ±1% 100mW 厚膜电阻; Supplier Part: C23234; Manufacturer: UNI-ROYAL(厚声); Supplier Footprint: 0603; JLCPCB Part Class: 基础库; Datasheet: https://atta.szlcsc.com/upload/public/pdf/source/20200306/C422600_1E6D84923E4A46A82E41ADD87F860B5C.pdf; Supplier: LCSC; Type: 厚膜电阻; Tolerance: ±1%; Power(Watts): 100mW; Overload Voltage (Max): 75V; Temperature Coefficient: ±100ppm/℃; Operating Temperature Range: -55℃~+155℃
R43 = 0603WAF2701T5E: 电阻类型:厚膜电阻;阻值:2.7kΩ;精度:±1%;功率:100mW;最大工作电压:75V;温度系数:±100ppm/℃;; LCSC Part Name: 2.7kΩ ±1% 100mW 厚膜电阻; Supplier Part: C13167; Manufacturer: UNI-ROYAL(厚声); Supplier Footprint: 0603; JLCPCB Part Class: 基础库; Datasheet: https://atta.szlcsc.com/upload/public/pdf/source/20200306/C422600_1E6D84923E4A46A82E41ADD87F860B5C.pdf; Supplier: LCSC; Type: 厚膜电阻; Tolerance: ±1%; Power(Watts): 100mW; Overload Voltage (Max): 75V; Temperature Coefficient: ±100ppm/℃; Operating Temperature Range: -55℃~+155℃
U1 U2 = SCT2450STER: 功能类型:降压型;工作电压:3.8V~36V;输出电流:5A;; LCSC Part Name: 3.8V-36V输入，5A输出，高效率同步降压DC-DC转换器; Supplier Part: C509400; Manufacturer: SCT(芯洲科技); Supplier Footprint: ESOP-8; JLCPCB Part Class: 扩展库; Datasheet: https://atta.szlcsc.com/upload/public/pdf/source/20200407/C509400_EDF779A672A59398CFBA9E95FA584FEC.pdf; Supplier: LCSC; Function: 降压型; Input Voltage: 3.8V~36V; Output Current: 5A; Switching Frequency: 100kHz~1.1MHz; Operating Temperature: -40℃~+125℃@(TJ); Synchronous Rectification: 是; Number of Outputs: 1; Switch tube (built-in/external): 内置
U3 = RT9013-33GB: 输出类型:固定;最大输入电压:5.5V;输出电压:3.3V;输出电流:500mA;电源纹波抑制比(PSRR):50dB@(10kHz);输出极性:正极;; LCSC Part Name: 输入5.5V 输出3.3V 500mA; Supplier Part: C47773; Manufacturer: RICHTEK(立锜); Supplier Footprint: SOT-23-5; JLCPCB Part Class: 扩展库; Datasheet: https://atta.szlcsc.com/upload/public/pdf/source/20150504/1457707282459.pdf; Supplier: LCSC; Output Type: 固定; Maximum Input Voltage: 5.5V; Output Voltage: 3.3V; Output Current: 500mA; Power Supply Rejection Ratio (PSRR): 50dB@(10kHz); Dropout Voltage: 400mV@(500mA); standby current: 50uA; Feature: 低ESR；防静电保护；热保护(TSD)；过流保护(OCP)；带使能; Operating Temperature: -40℃~+85℃; Output Polarity: 正极; Number of Outputs: 1

## Nets
3V3: C16.1 C17.1 R7.1 R8.1 R9.1 R10.1 R11.1 R12.1 R25.1 R43.1 R47.2 R48.2 U3.5(VOUT) 右编码器.2 屏幕1.13 左编码器.2 陀螺仪1.6
+5V: C14.1 C15.1 C35.2 CH1.29 D2.2(K) H1.7 R33.2 R36.2 U3.1(VIN) U3.3(EN) U11.5(VCC)
AGND: C34.1 C35.1 R44.2 R45.2 R55.1 R56.1 U8.56 U11.3(GND) USB1.1(GND) USB1.12(GND)
DGND: CH1.30 左编码器.1
GND: C1.1 C2.2 C3.1 C4.1 C5.1 C6.1 C7.2 C8.2 C9.1 C10.1 C11.1 C12.1 C13.2 C14.2 C15.2 C16.2 C17.2 C36.2 C37.2 C38.2 C39.2 CH1.19 CH1.20 CN5.1(-) CN5.3 CN5.4 CN6.1(-) CN6.3 CN6.4 LED1.1(K) LED2.1(K) LED3.1(-) R17.2 R23.2 R28.1 R31.1 R35.1 R37.1 R41.1 R49.2 R50.2 R52.2 R53.2 R54.2 R55.2 R56.2 S1.3(B2) S1.4(B1) U1.7(GND) U1.9(EP) U2.7(GND) U2.9(EP) U3.2(GND) U8.55 U12.2 U13.2 U14.2 U15.2 USB1.13(SHELL) USB1.14(SHELL) 屏幕1.15 陀螺仪1.5
VCCBAT: C8.1 C9.2 C10.2 CN6.2(+) D3.1(A) Q2.2(D) R22.2 U2.2(VIN) U2.3(EN)
VCCSERVO: C12.2 C13.1 L2.2 R39.2 R42.2 舵机1.2
11: C36.1 R9.2 R13.1 U12.1
22: C37.1 R10.2 R14.1 U13.1
33: C38.1 R11.2 R15.1 U14.1
44: C39.1 R12.2 R16.1 U15.1
AD7: C1.2 CH2.1 R22.1 R23.1
BGND: R52.1 U10.3 U10.4
CGND: H1.5 H1.6 R53.1
FGND: R50.1 舵机1.3
GGND: Q1.2 R17.1 R27.1 R54.1
GPIO12: R26.1 R27.2 U8.25
GPIO13: R16.2 U8.26
GPIO14: R15.2 U8.27
GPIO15: R14.2 U8.28
GPIO16: R13.2 U8.29
GPIO20: R5.2 U8.34
GPIO21: R6.2 U8.35
GPIO22: R47.1 U8.36 陀螺仪1.4
GPIO23: R48.1 U8.37 陀螺仪1.3
GPIO24: U8.38 陀螺仪1.2
GPIO25: U8.39 陀螺仪1.1
GPIO26: U8.40 屏幕1.5
GPIO50: CH1.16 右编码器.4
GPIO51: CH1.18 左编码器.4
GPIO60: CH1.21 屏幕1.11
GPIO62: CH1.27 屏幕1.9
GPIO63: CH1.23 屏幕1.3
GPIO64: CH1.22 左编码器.3
GPIO65: R3.1 U10.1
GPIO66: R4.1 U10.2
GPIO67: CH1.24 右编码器.3
GPIO72: R2.1 U10.6
GPIO73: R1.1 U10.5
GPIO74: CH1.14 屏幕1.7
GPIO75: CH1.12 屏幕1.1
GPIO86: R24.2 U8.49
GPIO88: CH1.4 R29.2
GPIO89: CH1.6 R30.2
HGND: R49.1 U9.1 U9.2
IGND: CH1.2 右编码器.1
RX0: CH1.5 H1.3 U11.6(TXD)
TX0: CH1.3 H1.1 U11.7(RXD)
UD+: U11.1(UD+) USB1.6(DP1) USB1.8(DP2)
UD-: U11.2(UD-) USB1.5(DN2) USB1.7(DN1)
$1N3242: R24.1 舵机1.1
$1N3250: CN5.2(+) D1.1(K) Q2.3(S) SW1.3
$1N3275: D1.2(A) R28.2 SW1.1
$1N3276: Q2.1(G) SW1.2
$1N3279: R5.1 R7.2 S1.1(A1)
$1N3280: R6.1 R8.2 S1.2(A2)
$1N3328: BUZZER1.2(-) Q1.3
$1N3332: BUZZER1.1(+) R25.2
$1N3334: Q1.1 R26.2
$1N3368: CH1.8 R1.2
$1N3374: CH1.10 R2.2
$1N3379: CH1.26 R3.2
$1N3382: CH1.28 R4.2
$1N4050: R30.1 U9.6
$1N4089: R29.1 U9.5
$1N7000: R44.1 USB1.10(CC2)
$1N7039: R45.1 USB1.4(CC1)
$1N7189: C34.2 U11.8(V3)
$2N1730: R37.2 U2.4(RT/CLK)
$2N1732: C33.2 U2.1(BOOT)
$2N1733: C33.1 L2.1 U2.8(SW)
$2N1736: C11.2 R38.1
$2N1737: R38.2 U2.6(COMP)
$2N1738: R39.1 R40.2
$2N1739: R40.1 R41.2 U2.5(FB)
$2N1740: LED3.2(+) R42.1
$2N1741: R31.2 U1.4(RT/CLK)
$2N1742: C2.1 C3.2 C4.2 D3.2(K) U1.2(VIN) U1.3(EN)
$2N1743: C32.2 U1.1(BOOT)
$2N1744: C32.1 L1.1 U1.8(SW)
$2N1746: C5.2 R32.1
$2N1747: R32.2 U1.6(COMP)
$2N1748: R34.1 R35.2 U1.5(FB)
$2N1749: LED2.2(A) R36.1
$2N1752: C6.2 C7.1 D2.1(A) L1.2
$2N1753: R33.1 R34.2
$2N1757: LED1.2(A) R43.2

Not connected (* = marked no-connect by the designer): CH1 1* 7* 9* 11* 13* 15* 17* 25*; CH2 2* 3* 4* 5* 6* 7* 8* 9* 10*; H1 2* 4* 8*; U3 4(NC)*; U8 1* 2* 3* 4* 5* 6* 7* 8* 9* 10* 11* 12* 13* 14* 15* 16* 17* 18* 19* 20* 21* 22* 23* 24* 30* 31* 32* 33* 41* 42* 43* 44* 45* 46* 47* 48* 50* 51* 52* 53* 54*; U9 3* 4*; U11 4(RTS#)*; USB1 2(VBUS)* 3(SBU2)* 9(SBU1)* 11(VBUS)*; 右编码器 5* 6*; 屏幕1 2* 4* 6* 8* 10* 12* 14* 16*; 左编码器 5* 6*

## Notes on the sheets
sheet 1
- 久久派接口
- 陀螺仪接口
- 电机接口
- 串口接口
- 屏幕接口
- 电源电压检测
- 编码器接口
- 舵机接口
- 蜂鸣器
- FPC接口
- 左
- 右
- 电池接口
- 电调接口
sheet 2
- 3V3稳压
- 5V稳压
- 舵机电源
